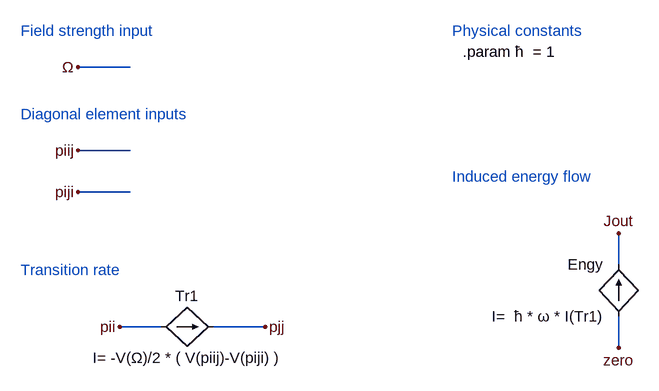
[diagram p0: schematic driven_rate_diag.asc]
driven_rate_diag.asc, the LTspice schematic file:
Version 4
SHEET 1 880 680
WIRE -64 -96 -144 -96
WIRE -64 32 -144 32
WIRE -64 96 -144 96
WIRE 688 208 688 160
WIRE -16 304 -80 304
WIRE 144 304 64 304
WIRE 688 336 688 288
FLAG -144 -96 Ω
FLAG -80 304 pii
FLAG 144 304 pjj
FLAG 688 160 Jout
FLAG 688 336 zero
FLAG -144 32 piij
FLAG -144 96 piji
SYMBOL bi -16 304 R270
WINDOW 0 32 40 VTop 2
WINDOW 3 -32 40 VBottom 2
SYMATTR InstName Tr1
SYMATTR Value I= -V(Ω)/2 * ( V(piij)-V(piji) )
SYMBOL bi 688 288 R180
WINDOW 0 24 80 Left 2
WINDOW 3 24 0 Left 2
SYMATTR InstName Engy
SYMATTR Value I=  ħ * ω * I(Tr1)
TEXT -232 -24 Left 2 ;Diagonal element inputs
TEXT -232 -152 Left 2 ;Field strength input
TEXT -232 216 Left 2 ;Transition rate
TEXT 432 -152 Left 2 ;Physical constants
TEXT 448 -120 Left 2 !.param ħ  = 1
TEXT 432 72 Left 2 ;Induced energy flow

The netlist it stands for:
* driven_rate_diag.asc
B§Tr1 pii pjj I= -V(Ω)/2 * ( V(piij)-V(piji) )
B§Engy zero Jout I=  ħ * ω * I(Tr1)
* Diagonal element inputs
* Field strength input
* Transition rate
* Physical constants
.param ħ  = 1
* Induced energy flow
.backanno
.end